# EAGLE design multicart (EAGLE 7.3.0)
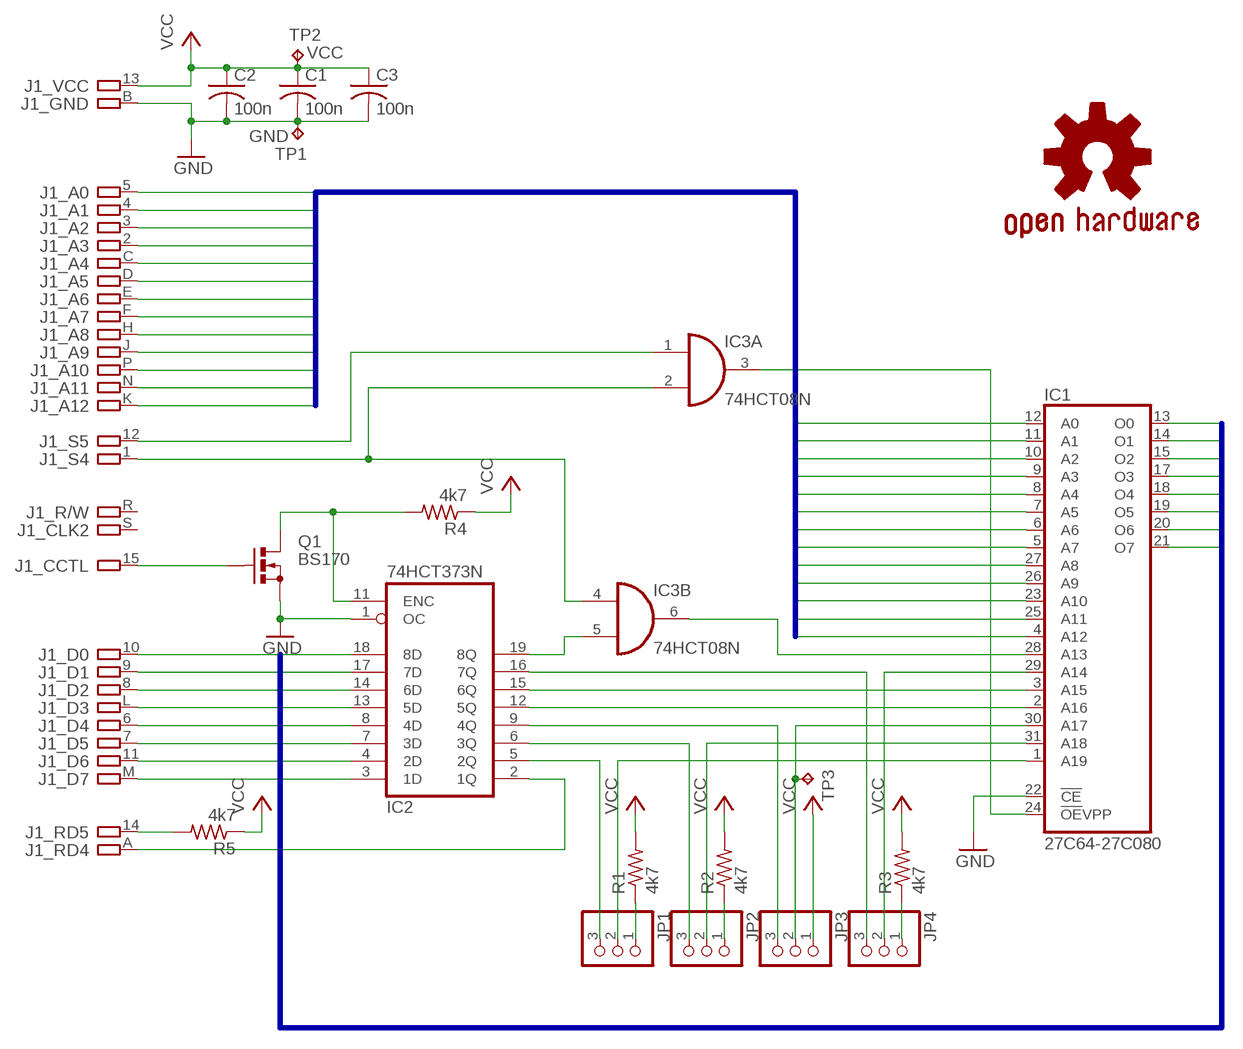
[diagram p0: schematic, sheet 1]

## Parts
C1  100n  C-US025-025X050  [C025-025X050]
C2  100n  C-US025-025X050  [C025-025X050]
C3  100n  C-US025-025X050  [C025-025X050]
GOLD_ORB_SM1  OSHWLOGO_GOLD_ORB_SM  [OSHW2]
IC1  27C64-27C080  27C08032P6  [DIL32]
IC2  74HCT373N  [DIL20]
IC3  74HCT08N  [DIL14]
J1  ATARI-800  [ATARI-800]
JP1  PINHD-1X3  [1X03]
JP2  PINHD-1X3  [1X03]
JP3  PINHD-1X3  [1X03]
JP4  PINHD-1X3  [1X03]
Q1  BS170  [SOT54E]
R1  4k7  R-US_0204/7  [0204/7]
R2  4k7  R-US_0204/7  [0204/7]
R3  4k7  R-US_0204/7  [0204/7]
R4  4k7  R-US_0204/7  [0204/7]
R5  4k7  R-US_0204/7  [0204/7]
TP1  TPB1,27  [B1,27]
TP2  TPB1,27  [B1,27]
TP3  TPB1,27  [B1,27]

## Nets
A0: IC1.12(A0) J1.5
A1: IC1.11(A1) J1.4
A2: IC1.10(A2) J1.3
A3: IC1.9(A3) J1.2
A4: IC1.8(A4) J1.C
A5: IC1.7(A5) J1.D
A6: IC1.6(A6) J1.E
A7: IC1.5(A7) J1.F
A8: IC1.27(A8) J1.H
A9: IC1.26(A9) J1.J
A10: IC1.23(A10) J1.P
A11: IC1.25(A11) J1.N
A12: IC1.4(A12) J1.K
D0: IC1.13(O0) IC2.18(8D) J1.10
D1: IC1.14(O1) IC2.17(7D) J1.9
D2: IC1.15(O2) IC2.14(6D) J1.8
D3: IC1.17(O3) IC2.13(5D) J1.L
D4: IC1.18(O4) IC2.8(4D) J1.6
D5: IC1.19(O5) IC2.7(3D) J1.7
D6: IC1.20(O6) IC2.4(2D) J1.11
D7: IC1.21(O7) IC2.3(1D) J1.M
GND: C1.2 C2.2 C3.2 IC1.22(!CE) IC2.1(OC) J1.B Q1.S TP1.TP
N$1: IC2.19(8Q) IC3.5(B:I1)
N$2: IC2.16(7Q) JP4.3
N$3: IC1.3(A15) IC2.15(6Q)
N$4: IC1.2(A16) IC2.12(5Q)
N$5: IC2.9(4Q) JP3.3
N$6: IC2.6(3Q) JP2.3
N$7: IC2.11(ENC) Q1.D R4.2
N$8: J1.15 Q1.G
N$9: JP1.1 R1.1
N$10: IC1.31(A18) JP2.2
N$11: JP2.1 R2.1
N$12: IC1.30(A17) JP3.2 TP3.TP
N$13: IC1.1(A19) JP1.2
N$14: IC2.5(2Q) JP1.3
N$15: IC1.29(A14) JP4.2
N$16: JP4.1 R3.1
N$17: J1.14 R5.2
N$18: IC3.1(A:I0) J1.12
N$19: IC3.2(A:I1) IC3.4(B:I0) J1.1
N$21: IC1.28(A13) IC3.6(B:O)
N$22: IC2.2(1Q) J1.A
N$27: IC1.24(!OE!VPP) IC3.3(A:O)
VCC: C1.1 C2.1 C3.1 J1.13 JP3.1 R1.2 R2.2 R3.2 R4.1 R5.1 TP2.TP
Unconnected: IC3.8(C:O) IC3.9(C:I0) IC3.10(C:I1) IC3.11(D:O) IC3.12(D:I0) IC3.13(D:I1) J1.R J1.S

## Buses
A[0..12]
D[0..7]

## Power pins joined to a net without a drawn wire
GND: IC1.16(GND) IC2.10(GND) IC3.7(P:GND)
VCC: IC1.32(VCC) IC2.20(VCC) IC3.14(P:VCC)

## Library data of the parts
C1-C3 = resistor:C-US: CAPACITOR, American symbol
GOLD_ORB_SM1 = bfl:OSHWLOGO: These are Open-Source Hardware logos.
IC1 = atmel:27C080: 8-Megabit (1Mx8) OTP EPROM; MPN: AT27C080-90PU; OC_FARNELL: 1455026; OC_NEWARK: 58M3824
IC2 = 74xx-eu:74*373: Octal D type transparent LATCH, edge triggered
IC3 = 74xx-eu:74*08: Quad 2-input AND gate
J1 = atari-800:ATARI-800: Atari 800 cartridge board
JP1-JP4 = pinhead:PINHD-1X3: PIN HEADER
Q1 = transistor-small-signal:BS170: N-CHANNEL MOS FET
R1-R5 = resistor:R-US_: RESISTOR, American symbol
TP1 = testpad:TP: Test pad; TP_SIGNAL_NAME: GND
TP2 = testpad:TP: Test pad; TP_SIGNAL_NAME: VCC
TP3 = testpad:TP: Test pad; TP_SIGNAL_NAME: DIP28 VCC

## Board
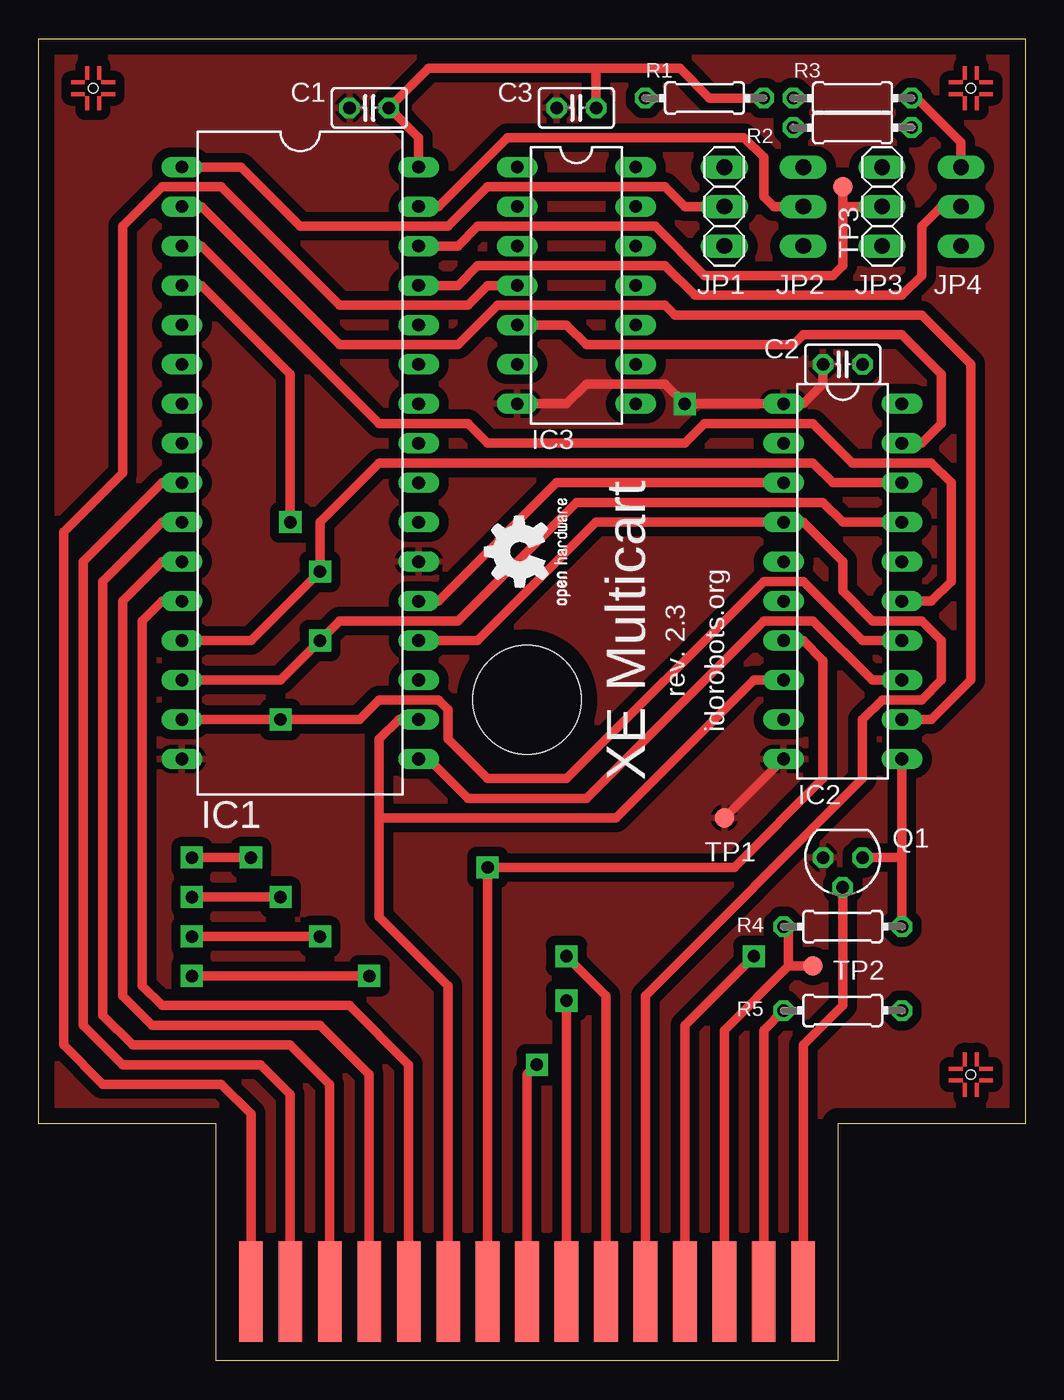
[diagram p1: board, top side]
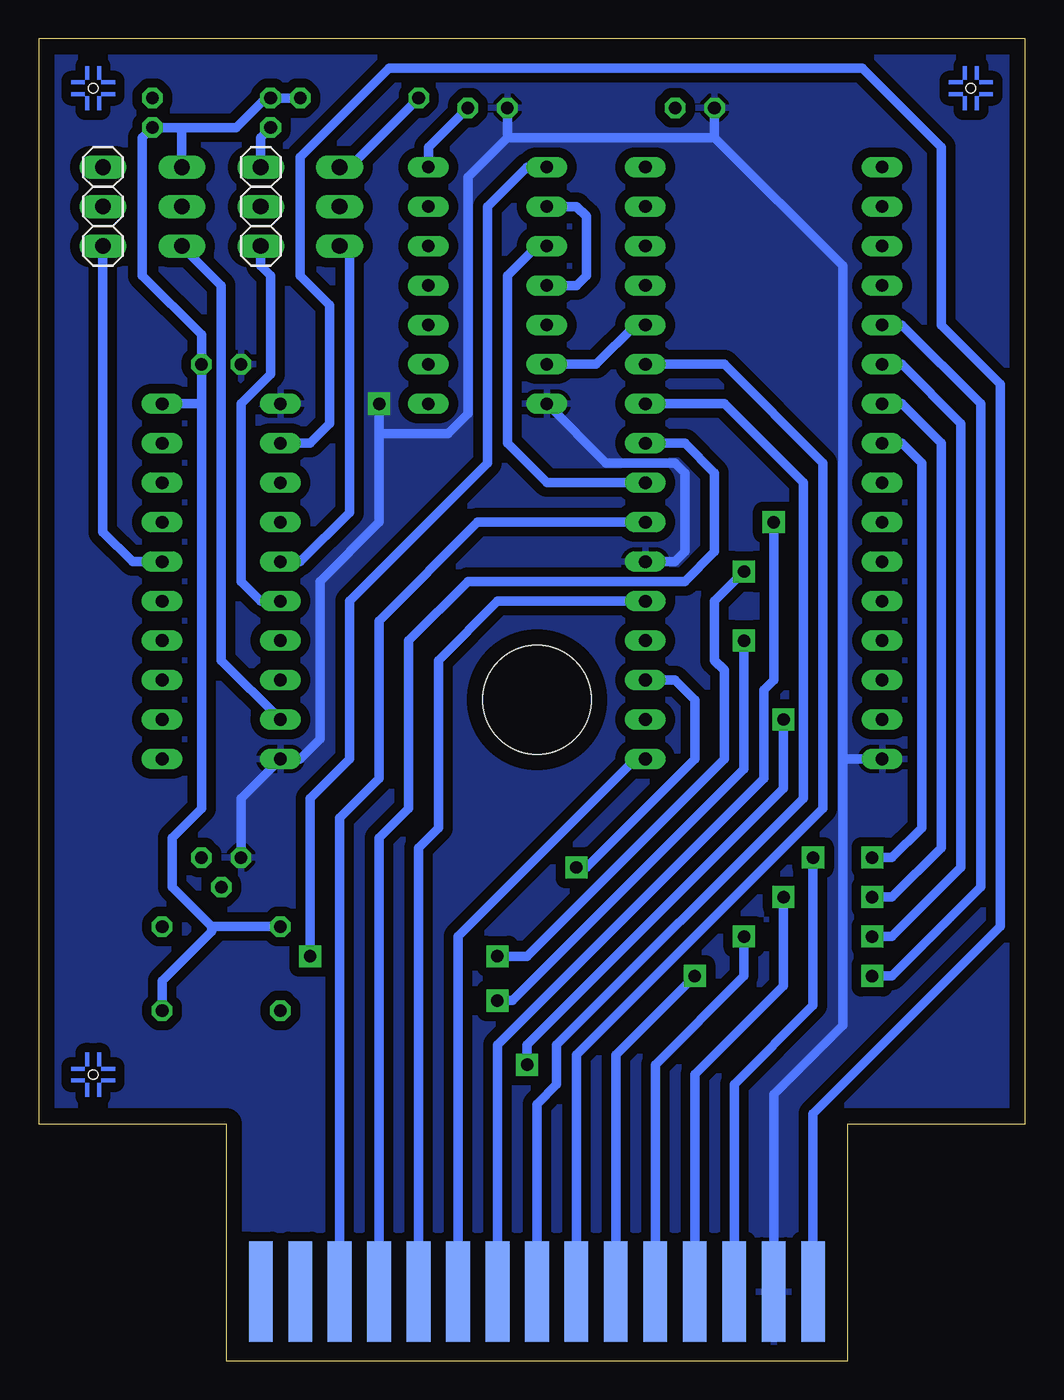
[diagram p2: board, bottom side, seen from below]

Size 63.5 x 85.09 mm. Coordinates in mm from the lower left corner, seen from the top.
Outline: 0,85.09 63.5,85.09 63.5,15.24 51.44,15.24 51.44,0 11.43,0 11.43,15.24 0,15.24 0,85.09
Copper layers (1*16): Top 0.035mm / dielectric 1.5mm / Bottom 0.035mm
Design rules "default": minimum track width 10mil, minimum drill 24mil, track to track 8mil, track to pad 8mil, pad to pad 8mil, via to via 8mil, smd to smd 8mil, copper to edge 40mil, drill to drill 8mil, minimum pad ring 10mil, minimum via ring 8mil, stop-mask expansion 4mil, vias tented up to drill 0mil, thermal gap 10mil
Holes 7 mm at 31.43,42.55

### Footprints (pad centres in the part's own frame; a part is rotated, then mirrored left to right if it is on the bottom)
C025-025X050 = drill 0.813 octagon: 1 -1.27,0; 2 1.27,0
DIL32 = drill 0.813 long: 1 -19.05,-7.62; 2 -16.51,-7.62; 3 -13.97,-7.62; 4 -11.43,-7.62; 5 -8.89,-7.62; 6 -6.35,-7.62; 7 -3.81,-7.62; 8 -1.27,-7.62; 9 1.27,-7.62; 10 3.81,-7.62; 11 6.35,-7.62; 12 8.89,-7.62; 13 11.43,-7.62; 14 13.97,-7.62; 15 16.51,-7.62; 16 19.05,-7.62; 17 19.05,7.62; 18 16.51,7.62; 19 13.97,7.62; 20 11.43,7.62; 21 8.89,7.62; 22 6.35,7.62; 23 3.81,7.62; 24 1.27,7.62; 25 -1.27,7.62; 26 -3.81,7.62; 27 -6.35,7.62; 28 -8.89,7.62; 29 -11.43,7.62; 30 -13.97,7.62; 31 -16.51,7.62; 32 -19.05,7.62
DIL20 = drill 0.813 long: 1 -11.43,-3.81; 2 -8.89,-3.81; 3 -6.35,-3.81; 4 -3.81,-3.81; 5 -1.27,-3.81; 6 1.27,-3.81; 7 3.81,-3.81; 8 6.35,-3.81; 9 8.89,-3.81; 10 11.43,-3.81; 11 11.43,3.81; 12 8.89,3.81; 13 6.35,3.81; 14 3.81,3.81; 15 1.27,3.81; 16 -1.27,3.81; 17 -3.81,3.81; 18 -6.35,3.81; 19 -8.89,3.81; 20 -11.43,3.81
DIL14 = drill 0.813 long: 1 -7.62,-3.81; 2 -5.08,-3.81; 3 -2.54,-3.81; 4 0,-3.81; 5 2.54,-3.81; 6 5.08,-3.81; 7 7.62,-3.81; 8 7.62,3.81; 9 5.08,3.81; 10 2.54,3.81; 11 0,3.81; 12 -2.54,3.81; 13 -5.08,3.81; 14 -7.62,3.81
ATARI-800 = smd 1.524 x 6.477: 1 -17.78,3.81; 2 -15.24,3.81; 3 -12.7,3.81; 4 -10.16,3.81; 5 -7.62,3.81; 6 -5.08,3.81; 7 -2.54,3.81; 8 0,3.81; 9 2.54,3.81; 10 5.08,3.81; 11 7.62,3.81; 12 10.16,3.81; 13 12.7,3.81; 14 15.24,3.81; 15 17.78,3.81 | smd 1.524 x 6.477 bottom: A -17.78,3.81; B -15.24,3.81; C -12.7,3.81; D -10.16,3.81; E -7.62,3.81; F -5.08,3.81; H -2.54,3.81; J 0,3.81; K 2.54,3.81; L 5.08,3.81; M 7.62,3.81; N 10.16,3.81; P 12.7,3.81; R 15.24,3.81; S 17.78,3.81
1X03 = drill 1.016 long: 1 -2.54,0; 2 0,0; 3 2.54,0
SOT54E = drill 0.813 octagon: D -1.27,0; G 0,1.905; S 1.27,0
0204/7 = drill 0.813 octagon: 1 -3.81,0; 2 3.81,0
B1,27 = smd 1.27 x 1.27: TP 0,0
PASSER-HOLE = hole 0.6: 0,0

### Placement (x,y rotation side)
C1  21.27,80.64 180 top
C2  51.75,64.14 180 top
C3  34.61,80.64 180 top
GOLD_ORB_SM1  35.24,48.26 90 top
IC1  16.83,57.78 270 top
IC2  51.75,50.16 270 top
IC3  34.61,69.22 270 top
J1  31.43,0.64 0 top
JP1  44.13,74.3 270 top
JP2  49.21,74.3 270 bottom
JP3  54.29,74.3 270 top
JP4  59.37,74.3 270 bottom
Q1  51.75,32.38 180 top
R1  42.86,81.28 0 top
R2  52.39,79.38 0 top
R3  52.39,81.28 180 top
R4  51.75,27.94 0 top
R5  51.75,22.54 180 top
TP1  44.13,34.92 0 top
TP2  49.85,25.4 0 top
TP3  51.75,75.56 0 top
U$1  [PASSER-HOLE]  3.49,81.92 0 top
U$2  [PASSER-HOLE]  3.49,81.92 0 bottom
U$3  [PASSER-HOLE]  60.01,81.92 0 bottom
U$4  [PASSER-HOLE]  60.01,81.92 0 top
U$5  [PASSER-HOLE]  60.01,18.41 0 top
U$6  [PASSER-HOLE]  60.01,18.41 0 bottom

### Tracks (layer width: path | path; a pad name or v marks a point on that pad's centre or on a via)
A0
  Top 0.61: IC1.12 7.94,48.9 6.67,47.62 6.67,24.13 7.94,22.86 20,22.86 23.81,19.05 J1.5
A1
  Top 0.61: IC1.11 7.94,51.44 5.4,48.9 5.4,23.5 7.3,21.59 18.1,21.59 21.27,18.41 J1.4
A2
  Top 0.61: J1.3 18.73,17.78 16.19,20.32 6.03,20.32 4.13,22.23 4.13,50.16 7.94,53.98 IC1.10
A3
  Top 0.61: J1.2 16.19,17.14 14.29,19.05 5.4,19.05 2.86,21.59 2.86,51.44 7.94,56.52 IC1.9
A4  (via drill 0.8 pad 1.42)
  Top 0.61: v9.84,32.38 v13.65,32.38
  Bottom 0.61: J1.C 18.73,17.78 13.65,22.86 v13.65,32.38 | IC1.8 7.94,59.05 6.67,57.78 6.67,34.29 8.57,32.38 v9.84,32.38
A5  (via drill 0.8 pad 1.42)
  Top 0.61: v9.84,29.84 v15.56,29.84
  Bottom 0.61: v15.56,29.84 15.56,24.13 21.27,18.41 J1.D | IC1.7 7.94,61.59 5.4,59.05 5.4,33.02 8.57,29.84 v9.84,29.84
A6  (via drill 0.8 pad 1.42)
  Top 0.61: v9.84,27.3 v18.1,27.3
  Bottom 0.61: IC1.6 7.94,64.14 4.13,60.33 4.13,31.75 8.57,27.3 v9.84,27.3 | J1.E 23.81,19.05 18.1,24.77 v18.1,27.3
A7  (via drill 0.8 pad 1.42)
  Top 0.61: v21.27,24.77 v9.84,24.77
  Bottom 0.61: IC1.5 7.94,66.67 2.86,61.59 2.86,30.48 8.57,24.77 v9.84,24.77 | J1.F 26.35,19.68 v21.27,24.77
A8
  Bottom 0.61: J1.H 28.89,19.68 13.02,35.56 13.02,57.78 19.37,64.14 IC1.27
A9
  Bottom 0.61: IC1.26 19.37,61.59 14.29,56.52 14.29,36.2 30.16,20.32 30.16,17.78 31.43,16.51 J1.J
A10
  Bottom 0.61: IC1.23 35.24,53.98 41.59,47.62 41.59,37.47 44.13,34.92 J1.P
A11
  Bottom 0.61: IC1.25 21.91,59.05 20,57.15 20,52.07 21.91,50.16 35.88,50.16 39.69,46.35 39.69,35.56 41.59,33.66 J1.N
A12  (via drill 0.8 pad 1.42)
  Top 0.61: v16.19,53.98 16.19,63.5 10.48,69.22 IC1.4
  Bottom 0.61: J1.K 33.97,20.32 16.83,37.47 16.83,43.18 16.19,43.81 v16.19,53.98
D0  (via drill 0.8 pad 1.42)
  Top 0.61: J1.10 36.51,23.5 v33.97,26.04 | IC2.18 51.12,56.52 49.85,57.78 21.91,57.78 18.1,53.98 v18.1,50.8 13.65,46.35 IC1.13
  Bottom 0.61: v33.97,26.04 32.07,26.04 19.37,38.73 19.37,44.45 20,45.09 20,48.9 v18.1,50.8
D1  (via drill 0.8 pad 1.42)
  Top 0.61: v33.97,23.18 J1.9 | IC1.14 15.56,43.81 v18.1,46.35 19.37,47.62 26.99,47.62 34.61,55.24 50.48,55.24 51.75,53.98 IC2.17
  Bottom 0.61: v18.1,46.35 18.1,38.1 33.02,23.18 v33.97,23.18
D2  (via drill 0.8 pad 1.42)
  Top 0.61: IC2.14 53.02,46.35 49.21,50.16 46.67,50.16 33.97,37.47 28.89,37.47 26.35,40.01 26.35,41.91 25.72,42.55 21.91,42.55 20.64,41.27 v15.56,41.27 IC1.15 | J1.8 31.43,18.41 v32.07,19.05
  Bottom 0.61: v15.56,41.27 15.56,36.83 32.07,20.32 v32.07,19.05
D3
  Top 0.61: IC2.13 53.66,43.81 49.85,47.62 46.67,47.62 35.24,36.2 27.62,36.2 25.08,38.73 IC1.17
  Bottom 0.61: J1.L 36.51,27.3 25.08,38.73 IC1.17
D4
  Top 0.61: J1.6 26.35,24.13 21.91,28.57 21.91,34.92 | 21.91,34.92 21.91,40.01 23.18,41.27 IC1.18 | IC2.8 46.04,43.81 37.15,34.92 21.91,34.92
D5  (via drill 0.8 pad 1.42)
  Top 0.61: IC2.7 49.21,46.35 50.48,45.09 50.48,37.47 44.77,31.75 v28.89,31.75 J1.7
  Bottom 0.61: IC1.19 22.54,43.81 21.27,42.55 21.27,38.73 28.26,31.75 v28.89,31.75
D6
  Top 0.61: J1.11 39.05,23.5 53.02,37.47 53.02,41.27 54.29,42.55 56.83,42.55 58.1,43.81 58.1,46.35 56.83,47.62 53.66,47.62 51.75,49.53 51.75,51.44 49.21,53.98 IC2.4 35.88,53.98 28.26,46.35 IC1.20
D7
  Top 0.61: IC1.21 25.72,48.9 33.34,56.52 IC2.3
  Bottom 0.61: J1.M 39.05,33.02 37.78,34.29 37.78,45.09 33.97,48.9 IC1.21
GND  (via drill 0.8 pad 1.42)
  Top 0.61: TP1.TP IC2.10 | IC3.7 33.97,61.59 35.24,62.87 40.32,62.87 v41.59,61.59 IC2.1 49.21,61.59 50.48,62.87 C2.2
  Bottom 0.61: 11.75,38.73 11.75,70.48 20,78.74 | J1.B 16.19,17.14 11.75,21.59 11.75,38.73 | 11.75,38.73 IC1.16 | IC1.22 22.54,51.44 21.91,52.07 21.91,57.15 22.54,57.78 26.99,57.78 IC3.7 | 20,78.74 33.34,78.74 | C1.2 20,78.74 | 33.34,78.74 35.88,76.2 35.88,60.96 37.15,59.69 41.59,59.69 | C3.2 33.34,78.74 | v41.59,61.59 41.59,59.69 | 41.59,59.69 41.59,53.98 45.4,50.16 45.4,40.01 46.67,38.73 IC2.10 50.48,36.2 Q1.S
  pour Bottom (isolate 0.61): 0,85.09 63.5,85.09 63.5,15.24 51.12,15.24 51.12,0 11.75,0 11.75,15.24 0,15.24
  pour Top (isolate 0.61): 0,15.24 11.75,15.24 11.75,0 51.12,0 51.12,15.24 63.5,15.24 63.5,85.09 0,85.09
N$1
  Top 0.61: IC3.5 33.97,66.67 35.24,65.41 48.58,65.41 49.21,66.04 55.56,66.04 58.1,63.5 58.1,60.33 56.83,59.05 IC2.19
N$2
  Bottom 0.61: IC2.16 57.47,51.44 59.37,53.34 JP4.3
N$3
  Top 0.61: IC1.3 10.48,71.75 21.91,60.33 27.62,60.33 28.89,59.05 41.59,59.05 42.86,60.33 49.85,60.33 52.39,57.78 57.47,57.78 58.74,56.52 58.74,50.16 57.47,48.9 IC2.15
N$4
  Top 0.61: IC2.12 57.47,41.27 60.01,43.81 60.01,64.14 56.83,67.31 40.96,67.31 40.32,67.94 29.53,67.94 26.99,65.41 19.37,65.41 10.48,74.3 IC1.2
N$5
  Bottom 0.61: JP3.3 51.75,69.22 51.75,45.09 IC2.9
N$6
  Bottom 0.61: IC2.6 49.21,48.9 50.48,50.16 50.48,61.59 48.58,63.5 48.58,69.85 49.21,70.48 JP2.3
N$7
  Top 0.61: IC2.11 55.56,32.38 | 55.56,32.38 R4.2 | Q1.D 55.56,32.38
N$8
  Top 0.61: Q1.G 51.75,22.86 49.21,20.32 J1.15
N$9
  Bottom 0.61: JP1.1 43.5,76.83 R1.1
N$10
  Top 0.61: IC1.31 25.72,74.3 30.16,78.74 45.4,78.74 46.67,77.47 46.67,74.93 47.31,74.3 JP2.2
N$11
  Bottom 0.61: JP2.1 49.21,78.74 R2.1
N$12
  Top 0.61: IC1.30 26.99,71.75 28.26,73.03 39.69,73.03 42.86,69.85 51.12,69.85 51.75,70.48 51.75,74.3 | JP3.2 51.75,74.3 | 51.75,74.3 TP3.TP
N$13
  Top 0.61: JP1.2 41.59,74.3 40.32,75.56 28.89,75.56 26.35,73.03 16.83,73.03 13.02,76.83 IC1.1
N$14
  Bottom 0.61: IC2.5 46.67,51.44 43.5,54.61 43.5,71.12 JP1.3
N$15
  Top 0.61: IC1.29 26.99,69.22 28.26,70.48 40.32,70.48 42.23,68.58 55.56,68.58 56.83,69.85 56.83,73.03 58.1,74.3 JP4.2
N$16
  Top 0.61: JP4.1 59.37,78.42 56.52,81.28 R3.1
N$17
  Top 0.61: J1.14 46.67,21.27 R5.2
N$18  (via drill 0.8 pad 1.42)
  Top 0.61: J1.12 41.59,21.59 v46.04,26.04
  Bottom 0.61: IC3.1 32.07,76.83 34.61,74.3 34.61,57.78 43.5,48.9 43.5,38.73 46.04,36.2 v46.04,26.04
N$19
  Top 0.61: J1.1 13.65,15.88 11.75,17.78 4.13,17.78 1.59,20.32 1.59,53.34 5.4,57.15 5.4,73.03 7.94,75.56 11.75,75.56 19.37,67.94 27.62,67.94 28.89,69.22 IC3.4
  Bottom 0.61: IC3.4 28.89,69.22 28.26,69.85 28.26,73.66 28.89,74.3 IC3.2
N$21
  Bottom 0.61: IC3.6 27.62,64.14 25.08,66.67 IC1.28
N$22
  Bottom 0.61: J1.A 13.65,15.88 1.59,27.94 1.59,62.87 5.4,66.67 5.4,78.11 10.48,83.19 40.96,83.19 46.67,77.47 46.67,69.85 44.77,67.94 44.77,60.33 46.04,59.05 IC2.2
N$27
  Bottom 0.61: IC3.3 31.43,71.75 33.34,69.85 33.34,59.05 30.8,56.52 IC1.24
VCC
  Top 0.61: J1.13 44.13,21.27 48.26,25.4 | 35.88,83.19 25.08,83.19 C1.1 24.45,78.74 IC1.32 | C3.1 35.88,83.19 | R1.2 43.18,81.28 41.27,83.19 35.88,83.19 | R4.1 48.26,27.62 48.26,25.4 | TP2.TP 48.26,25.4
  Bottom 0.61: 54.29,79.38 R2.2 56.83,78.74 56.83,69.85 53.02,66.04 C2.1 53.02,61.59 | JP3.1 54.29,79.38 | IC3.14 38.42,78.11 C3.1 | 53.02,61.59 53.02,35.56 54.93,33.66 54.93,30.48 52.39,27.94 | 52.39,27.94 R4.1 | IC2.20 53.02,61.59 | R1.2 R3.2 48.9,81.28 50.8,79.38 54.29,79.38 | 52.39,27.94 52.39,27.62 55.56,24.45 R5.1

### Text on the board
tPlace: XE Multicart | rev. 2.3 | idorobots.org